# EAGLE schematic Esquematico v2 (EAGLE 9.7.0)
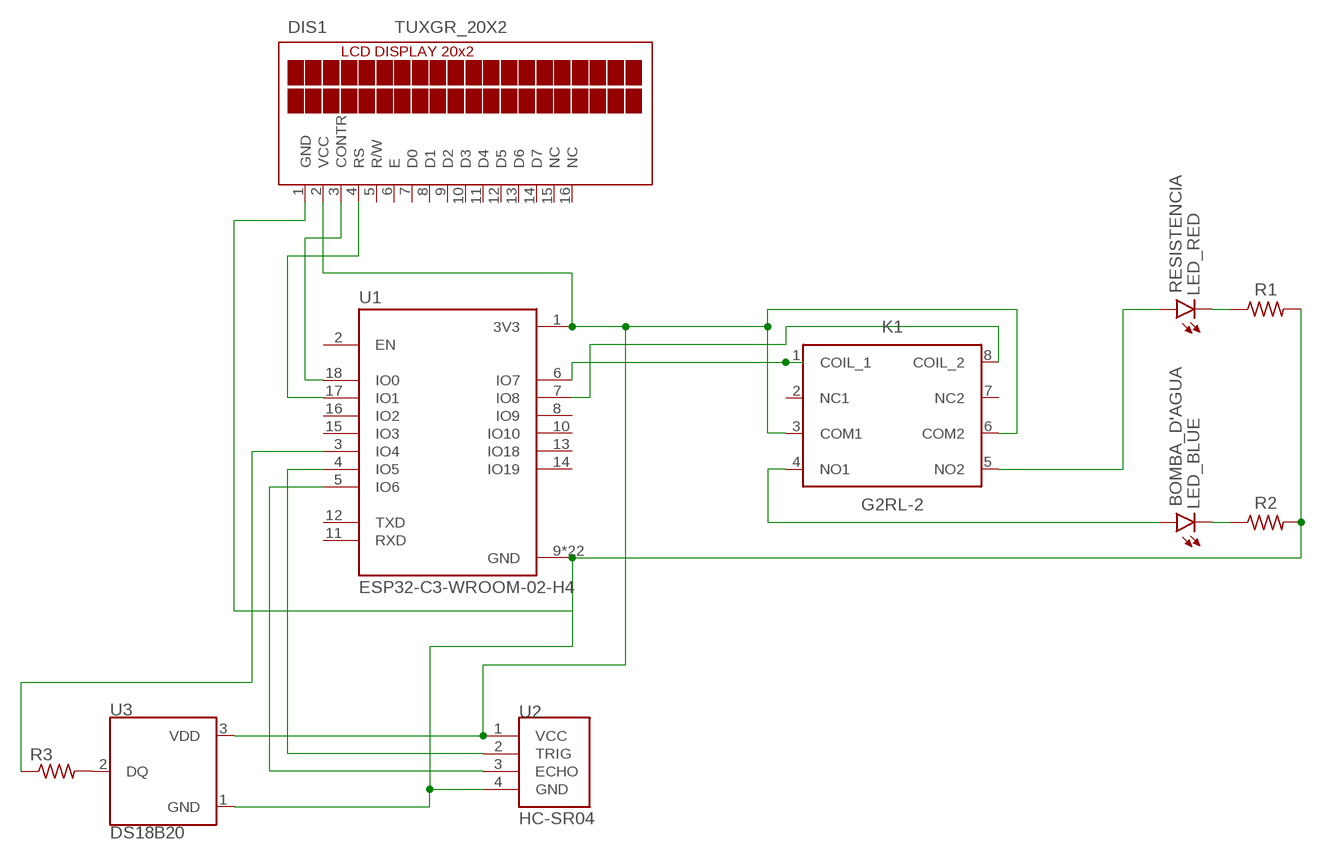
[diagram p0: schematic, sheet 1]

## Parts
BOMBA_D'AGUA  LED_BLUE  LED_RADIAL_BLUE  [LEDRD254W60D565H860B_B]
DIS1  TUXGR_20X2  [TUXGR_20X2]
K1  G2RL-2  [G2RL-2]
R1  R-US_AXIAL-7.2MM-PITCH  [RESAD724W46L381D178B]
R2  R-US_AXIAL-7.2MM-PITCH  [RESAD724W46L381D178B]
R3  R-US_AXIAL-7.2MM-PITCH  [RESAD724W46L381D178B]
RESISTENCIA  LED_RED  LED_RADIAL_RED  [LEDRD254W60D565H860B]
U1  ESP32-C3-WROOM-02-H4  [MODULE_ESP32-C3-WROOM-02-H4]
U2  HC-SR04  [XCVR_HC-SR04]
U3  DS18B20  [TO-92-TO92127P495H2044-3]

## Nets
N$1: R1.1 RESISTENCIA.2(C)
N$2: BOMBA_D'AGUA.2(C) R2.1
N$3: K1.1(COIL_1) U1.6(IO7)
N$4: K1.5(NO2) RESISTENCIA.1(A)
N$5: BOMBA_D'AGUA.1(A) K1.4(NO1)
N$6: DIS1.2(VCC) K1.3(COM1) K1.6(COM2) U1.1(3V3) U2.1(VCC) U3.3(VDD)
N$7: K1.8(COIL_2) U1.7(IO8)
N$8: DIS1.1(GND) R1.2 R2.2 U1.9(GND) U1.19(GND) U1.20(GND) U1.21(GND) U1.22(GND) U1.23(GND) U1.24(GND) U1.25(GND) U1.26(GND) U1.27(GND) U1.28(GND) U1.29(GND) U1.30(GND) U1.31(GND) U1.32(GND) U1.33(GND) U1.34(GND) U1.35(GND) U1.36(GND) U1.37(GND) U1.38(GND) U1.39(GND) U2.4(GND) U3.1(GND)
N$9: U1.5(IO6) U2.3(ECHO)
N$10: U1.4(IO5) U2.2(TRIG)
N$11: R3.2 U3.2(DQ)
N$12: R3.1 U1.3(IO4)
N$13: DIS1.3(CONTR) U1.18(IO0)
N$14: DIS1.4(RS) U1.17(IO1)
Unconnected: DIS1.5(R/W) DIS1.6(E) DIS1.7(D0) DIS1.8(D1) DIS1.9(D2) DIS1.10(D3) DIS1.11(D4) DIS1.12(D5) DIS1.13(D6) DIS1.14(D7) DIS1.15(NC) DIS1.16(NC) K1.2(NC1) K1.7(NC2) U1.2(EN) U1.8(IO9) U1.10(IO10) U1.11(RXD) U1.12(TXD) U1.13(IO18) U1.14(IO19) U1.15(IO3) U1.16(IO2)

## Library data of the parts
BOMBA_D'AGUA RESISTENCIA = Atividade 3 Library:LED_RADIAL: LED - Generic; CATEGORY: Opto-Electronic; SUB-CATEGORY: LED
DIS1 = display-lcd:TUXGR_20X2: Tuxgraphics LCD display 20x2 characters reflective, without background light Source: tuxgr_20x2.pdf; OC_FARNELL: unknown; OC_NEWARK: unknown
K1 = Relay:G2RL-2: CONTACT TYPE : DPDT COIL RATING : 5 to 48 VDC Datasheet <https://omronfs.omron.com/en_US/ecb/products/pdf/en-g2rl.pdf>; CATEGORY: RELAY; MANUFACTURER: OMRON; OPERATING_TEMP: 40°C to 85°C; PART_STATUS: ACTIVE; ROHS_COMPLIANCE: ROHS COMPLIANT; SERIES: G2RL; SUB-CATEGORY: Power Relay; TYPE: DPDT
R1 R2 = Resistor:R-US: Resistor Fixed - ANSI; CATEGORY: Resistor; SUB-CATEGORY: Fixed
R3 = Tutorial - Fusion 360:R-US: Resistor Fixed - ANSI; CATEGORY: Resistor; SUB-CATEGORY: Fixed
U1 = ESP32-C3-WROOM-02-H4:ESP32-C3-WROOM-02-H4: WiFi Modules (802.11) (Engineering Samples) SMD module, ESP32-C3, 4MB SPI flash, PCB antenna, -40 C +105 C Check availability <https://pricing.snapeda.com/parts/ESP32-C3-WROOM-02-H4/Espressif%20Systems/view-part?ref=eda> Check availability <https://pricing.snapeda.com/parts/ESP32-C3-WROOM-02-H4/Espressif%20Systems/view-part?ref=eda> Check availability <https://pricing.snapeda.com/parts/ESP32-C3-WROOM-02-H4/Espressif%20Systems/view-part?ref=eda>; AVAILABILITY: In Stock; DESCRIPTION: WiFi Modules (802.11) (Engineering Samples) SMD module, ESP32-C3, 4MB SPI flash, PCB antenna, -40 C +105 C; MF: Espressif Systems; MP: ESP32-C3-WROOM-02-H4; PACKAGE: Package; PRICE: None; PURCHASE-URL: https://pricing.snapeda.com/search/part/ESP32-C3-WROOM-02-H4/?ref=eda
U2 = HC-SR04:HC-SR04: Ultrasonic Sensor Module; MANUFACTURER: Osepp
U3 = DS18B20:DS18B20: digital thermometer -55C-125C TO92-3; MANUFACTURER: Maxim Integrated; PARTREV: 5; STANDARD: IPC-7251